# EAGLE design fethe (EAGLE 4.13)
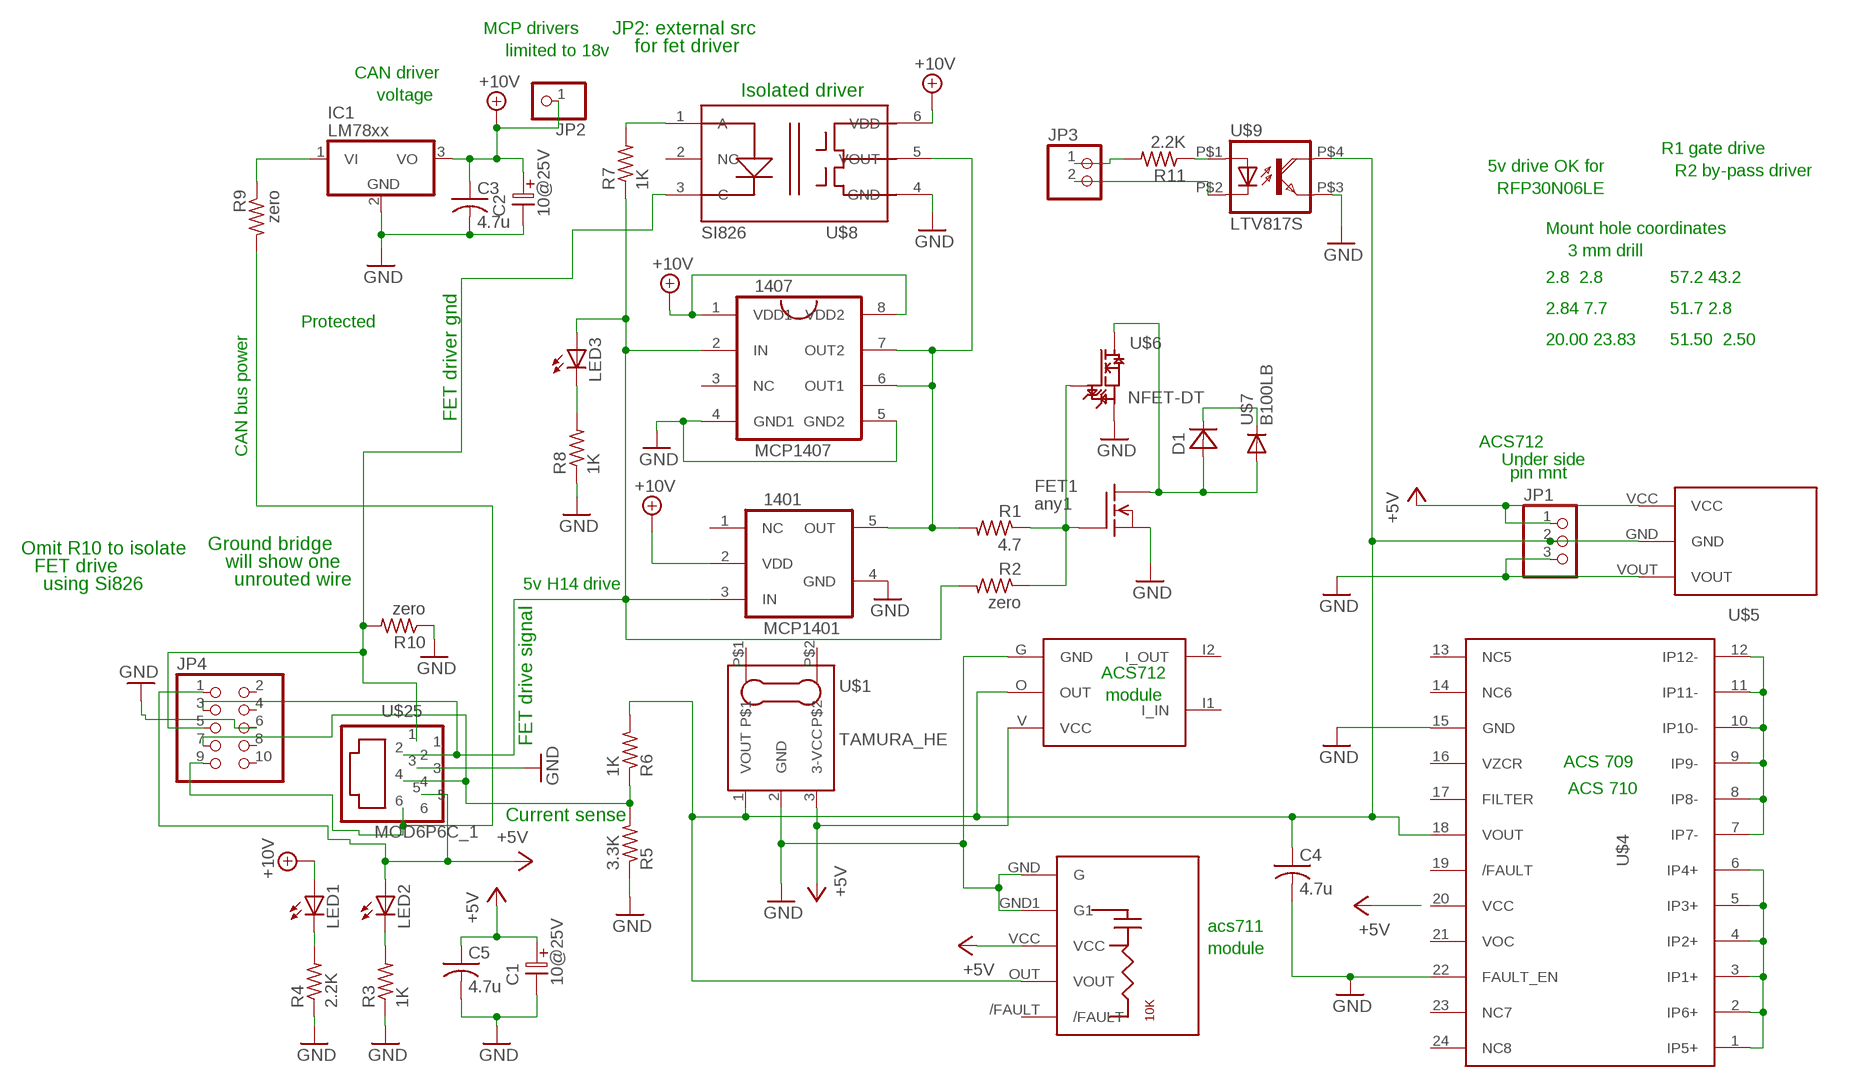
[diagram p0: schematic, sheet 1]

## Parts
1401  MCP1401  MCP1416  [SOT23-5]
1407  MCP1407  [SO8]
C1  10@25V  ELC-2,5L  [ES-2,5L]
C2  10@25V  ELC-2,5L  [ES-2,5L]
C3  4.7u  C-USC0603  [C0603]
C4  4.7u  C-USC0603  [C0603]
C5  4.7u  C-USC0603  [C0603]
D1  DIODE-10  [D-10]
FET1  any1  FET220V  [TO220V]
IC1  LM78xx  78V  [TO220V]
JP1  PINHD-1X3  [1X03]
JP2  PINHD-1X1  [1X01]
JP3  PINHD-1X2  [1X02]
JP4  PINHD-2X5  [2X05]
LED1  LEDCHIPLED_0805  [CHIPLED_0805]
LED2  LEDCHIPLED_0805  [CHIPLED_0805]
LED3  LEDCHIPLED_0805  [CHIPLED_0805]
R1  4.7  R-US_R0603  [R0603]
R2  zero  R-US_R0603  [R0603]
R3  1K  R-US_R0603  [R0603]
R4  2.2K  R-US_R0603  [R0603]
R5  3.3K  R-US_R0603  [R0603]
R6  1K  R-US_R0603  [R0603]
R7  1K  R-US_R0603  [R0603]
R8  1K  R-US_R0603  [R0603]
R9  zero  R-US_R0603  [R0603]
R10  zero  R-US_R0603  [R0603]
R11  2.2K  R-US_R0603  [R0603]
U$1  TAMURA_HE  [TAMURA_HE]
U$2  ACS712MODULE  [ACS712MODULE]
U$3  ACS711MODULE  [ACS711MODULE]
U$4  ACS709/710  [SO24W]
U$5  ACS755  [ACS755]
U$6  NFET-DT  [D-PAK-4]
U$7  B100LB  [SMB_1]
U$8  SI826  [SDIP6]
U$9  LTV817S  LTV316S  [LTV316]
U$25  MOD6P6C_1  [MOD6P6C_1]

## Nets
+5V: C1.1 C5.1 JP1.1 JP4.1 LED2.A U$1.3(3-VCC) U$2.V(VCC) U$3.VCC U$5.VCC U$25.5
+10V: 1401.2(VDD) 1407.1(VDD1) 1407.8(VDD2) C2.1 C3.1 IC1.3(VO) JP2.1 LED1.A U$8.6(VDD)
B5BUF: 1401.3(IN) 1407.2(IN) JP4.3 LED3.A R2.2 R7.1 U$25.2
DIV1: JP4.7 R5.2 R6.1 U$25.4
DRV_OUT: 1401.5(OUT) 1407.6(OUT1) 1407.7(OUT2) R1.2 U$8.5(VOUT)
FET-DRAIN: D1.1(A) FET1.2(D) U$6.D U$7.A
FET_DRIVE_1: FET1.1(G) R1.1 R2.1 U$6.G
GND: 1401.4(GND) 1407.4(GND1) 1407.5(GND2) C1.2 C2.2 C3.2 C4.2 C5.2 FET1.3(S) IC1.2(GND) JP1.3 JP4.6 R3.1 R4.1 R5.1 R8.1 R10.1 U$1.2(GND) U$2.G(GND) U$3.GND1(G1) U$3.GND(G) U$4.15(GND) U$4.22(FAULT_EN) U$5.VOUT U$6.S U$8.4(GND) U$9.P$3(EMI) U$25.3
GNDFETDRV: JP4.5 R10.2 U$8.3(C) U$25.1
I+: U$4.1(IP5+) U$4.2(IP6+) U$4.3(IP1+) U$4.4(IP2+) U$4.5(IP3+) U$4.6(IP4+)
I-: U$4.7(IP7-) U$4.8(IP8-) U$4.9(IP9-) U$4.10(IP10-) U$4.11(IP11-) U$4.12(IP12-)
ISO_IN_A: R11.1 U$9.P$1(A)
ISO_IN_C: JP3.2 U$9.P$2(C)
ISO_IN_PLUS: JP3.1 R11.2
LED1: LED1.C R4.2
LED2: LED2.C R3.2
LED3: LED3.C R8.2
POWER_PLUS: D1.2(K) U$7.C
SI826A: R7.2 U$8.1(A)
VI_12V: JP4.9 R9.2 U$25.6
VOUT: C4.1 JP1.2 R6.2 U$1.1(VOUT) U$2.O(OUT) U$3.OUT(VOUT) U$4.18(VOUT) U$5.GND U$9.P$4(COL)
VRIN: IC1.1(VI) R9.1
Unconnected: 1401.1(NC) 1407.3(NC) JP4.2 JP4.4 JP4.8 JP4.10 U$1.P$1 U$1.P$2 U$2.I1(I_IN) U$2.I2(I_OUT) U$3./FAULT U$4.13(NC5) U$4.14(NC6) U$4.16(VZCR) U$4.17(FILTER) U$4.19(/FAULT) U$4.20(VCC) U$4.21(VOC) U$4.23(NC7) U$4.24(NC8) U$8.2(NC)

## Notes on the sheet
- MCP drivers | JP2: external src
- limited to 18v | for fet driver
- CAN driver
- voltage | Isolated driver
- R1 gate drive
- 5v drive OK for | R2 by-pass driver
- RFP30N06LE
- Mount hole coordinates
- 3 mm drill
- 2.8  2.8 | 57.2 43.2
- 2.84 7.7 | 51.7 2.8
- Protected
- 20.00 23.83 | 51.50  2.50
- FET driver gnd
- ACS712
- CAN bus power
- Under side
- pin mnt
- Omit R10 to isolate | Ground bridge
- FET drive | will show one
- using Si826 | unrouted wire | 5v H14 drive
- ACS712
- module
- FET drive signal
- ACS 709
- ACS 710
- Current sense
- acs711
- module

## Library data of the parts
1401 = DEH:MCP1416
1407 = DEH:MCP1407
C1 C2 = DEH:ELC-2,5L
C3-C5 = rcl:C-US: CAPACITOR, American symbol
D1 = DEH:DIODE-10
FET1 = transistor-fet:FET220V
IC1 = linear:78*: Positive VOLTAGE REGULATOR
JP1 = pinhead:PINHD-1X3: PIN HEADER
JP2 = pinhead:PINHD-1X1: PIN HEADER
JP3 = pinhead:PINHD-1X2: PIN HEADER
JP4 = pinhead:PINHD-2X5: PIN HEADER
LED1-LED3 = led:LED: LED OSRAM: - CHIPLED LG R971, LG N971, LY N971, LG Q971, LY Q971, LO R971, LY R971 LH N974, LH R974 LS Q976, LO Q976, LY Q976 LO Q996 - Hyper CHIPLED LW Q18S LB Q993, LB Q99A, LB R99A - SideLED LS A670, LO A670, LY A670, LG A670, LP A670 LB A673, LV A673, LT A673, LW A673 LH A674 LY A675 LS A676, LA A676, LO A676, LY A676, LW A676 LS A679, LY A679, LG A679 - Hyper Micro SIDELED® LS Y876, LA Y876, LO Y876, LY Y876 LT Y87S - SmartLED LW L88C, LW L88S LB L89C, LB L89S, LG L890 LS L89K, LO L89K, LY L89K LS L896, LA L896, LO L896, LY L896 - TOPLED LS T670, LO T670, LY T670, LG T670, LP T670 LSG T670, LSP T670, LSY T670, LOP T670, LYG T670 LG T671, LOG T671, LSG T671 LB T673, LV T673, LT T673, LW T673 LH T674 LS T676, LA T676, LO T676, LY T676, LB T676, LH T676, LSB T676, LW T676 LB T67C, LV T67C, LT T67C, LS T67K, LO T67K, LY T67K, LW E67C LS E67B, LA E67B, LO E67B, LY E67B, LB E67C, LV E67C, LT E67C LW T67C LS T679, LY T679, LG T679 LS T770, LO T770, LY T770, LG T770, LP T770 LB T773, LV T773, LT T773, LW T773 LH T774 LS E675, LA E675, LY E675, LS T675 LS T776, LA T776, LO T776, LY T776, LB T776 LHGB T686 LT T68C, LB T68C - Hyper Mini TOPLED® LB M676 - Mini TOPLED Santana® LG M470 LS M47K, LO M47K, LY M47K Source: http://www.osram.convergy.de/
R1-R11 = rcl:R-US_: RESISTOR, American symbol
U$1 = DEH:TAMURA_HE
U$2 = DEH:ACS712MODULE
U$3 = DEH:ACS711MODULE
U$4 = DEH:ACS709/710
U$5 = DEH:ACS755
U$6 = DEH:NFET-DT
U$7 = diode-1:B100LB
U$8 = DEH:SI826
U$9 = optocoupler:LTV316S
U$25 = DEH:MOD6P6C_1

## Board
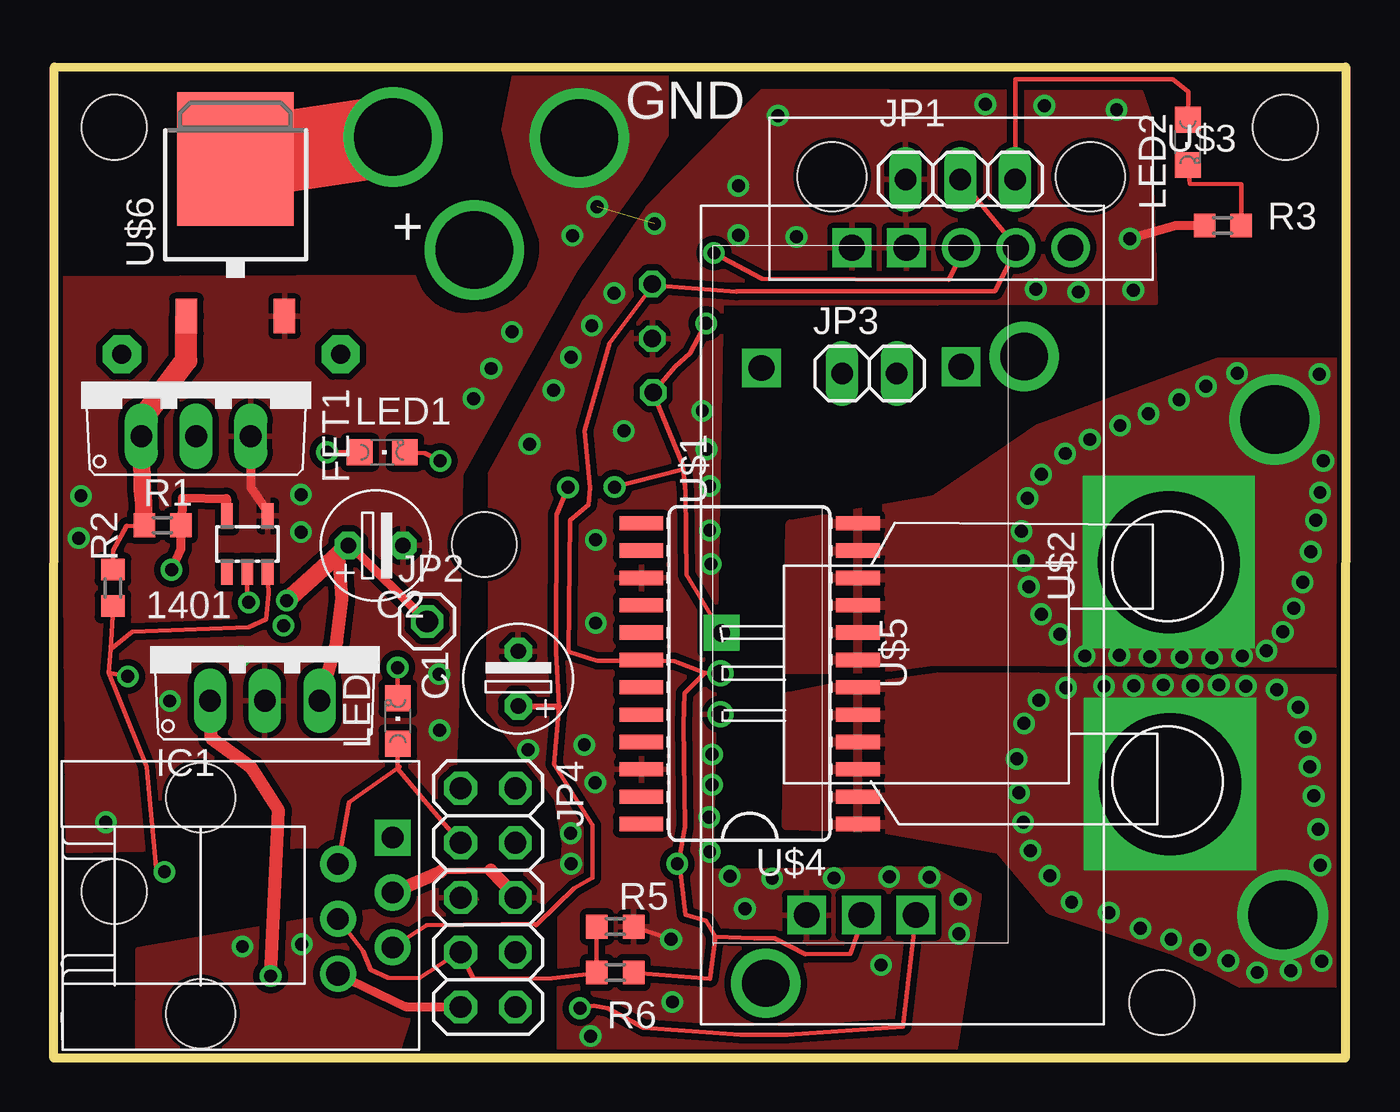
[diagram p1: board, top side]
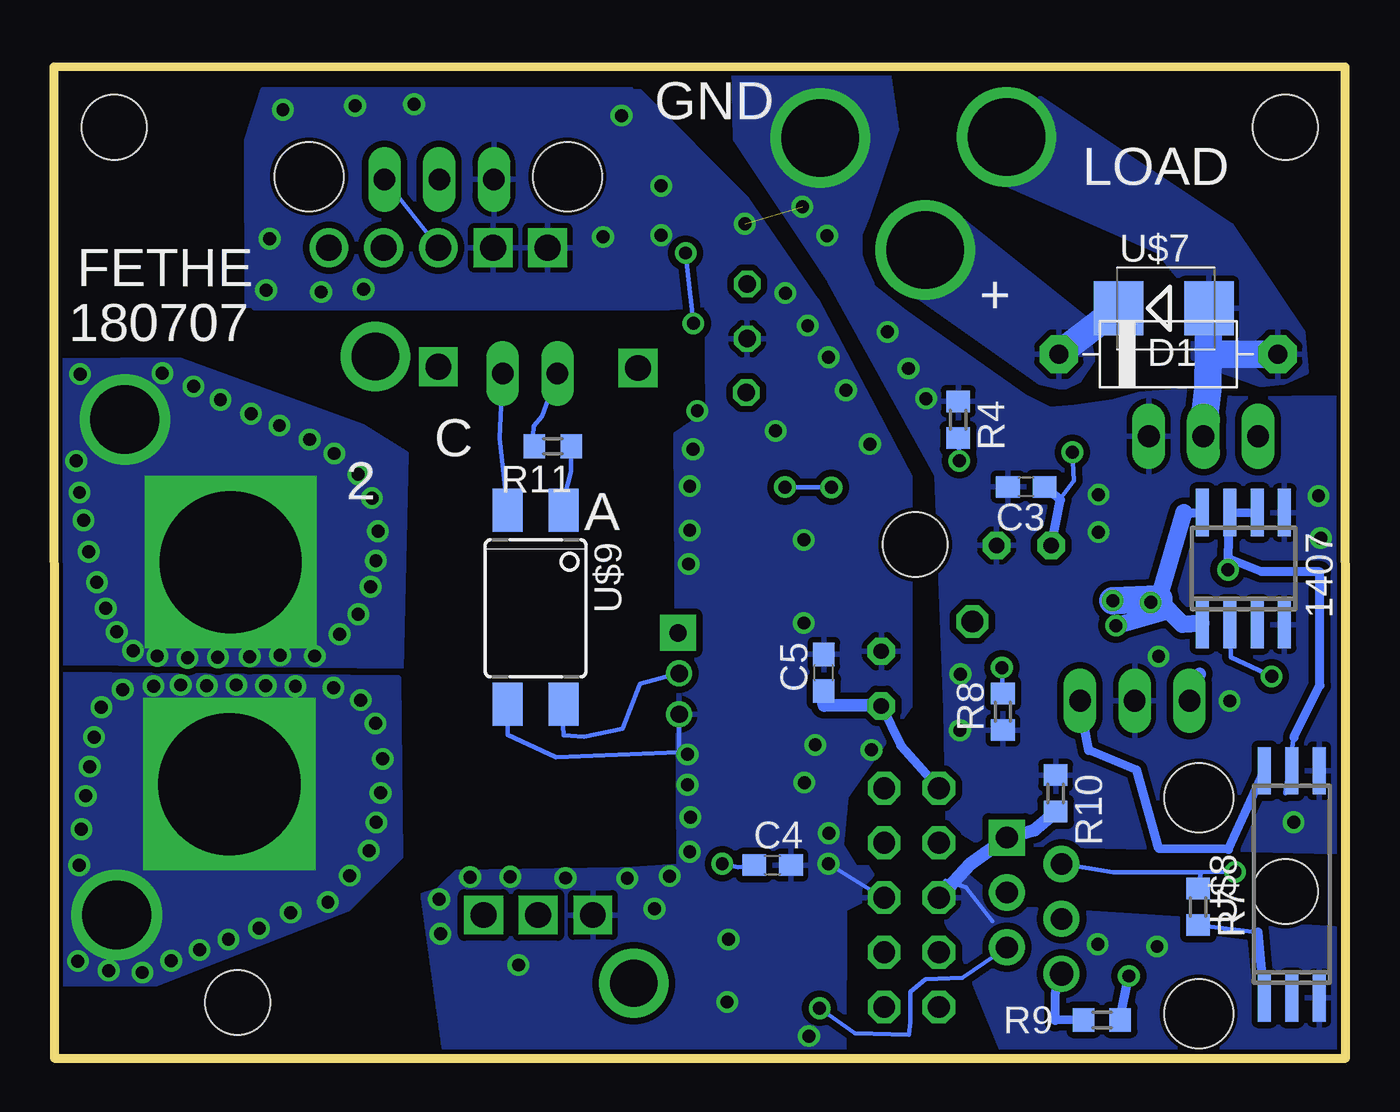
[diagram p2: board, bottom side, seen from below]

Size 60.01 x 46.02 mm. Coordinates in mm from the lower left corner, seen from the top.
Outline: 0,0 0.02,46.01 60.01,46.02 59.98,0 0,0
Copper layers (1*16): Top 0.035mm / dielectric 1.5mm / Bottom 0.035mm
Design rules "default": minimum track width 8mil, minimum drill 0.6mm, track to track 12mil, track to pad 10mil, pad to pad 10mil, via to via 8mil, smd to smd 0mil, copper to edge 8mil, drill to drill 8mil, minimum pad ring 8mil, minimum via ring 8mil, stop-mask expansion 4mil, vias tented up to drill 0mil, thermal gap 10mil
Holes 3 mm at 2.81,43.22 57.21,43.22 51.47,2.58 20,23.85 2.81,7.73

### Footprints (pad centres in the part's own frame; a part is rotated, then mirrored left to right if it is on the bottom)
SOT23-5 = smd 0.55 x 1.2: 1 -0.95,-1.3; 2 0,-1.3; 3 0.95,-1.3; 4 0.95,1.3; 5 -0.95,1.3
SO8 = smd 0.6 x 2.2: 1 -1.905,-2.6; 2 -0.635,-2.6; 3 0.635,-2.6; 4 1.905,-2.6; 5 1.905,2.6; 6 0.635,2.6; 7 -0.635,2.6; 8 -1.905,2.6
ES-2,5L = drill 0.711 pad 1.27 octagon: 1 0,0; 2 2.54,0
C0603 = smd 1.1 x 1: 1 -0.85,0; 2 0.85,0
D-10 = drill 0.889 pad 1.778 octagon: 1 -5.08,0; 2 5.08,0
TO220V = drill 1.016 long: 1 -2.54,-2.54; 2 0,-2.54; 3 2.54,-2.54
TO220V' = drill 1 long: 1 -2.54,1.27; 2 0,1.27; 3 2.54,1.27
1X03 = drill 1 long: 1 -2.54,0; 2 0,0; 3 2.54,0
1X01 = drill 1 octagon: 1 0,0
1X02 = drill 1 long: 1 -1.27,0; 2 1.27,0
2X05 = drill 1.016 octagon: 1 -5.08,-1.27; 2 -5.08,1.27; 3 -2.54,-1.27; 4 -2.54,1.27; 5 0,-1.27; 6 0,1.27; 7 2.54,-1.27; 8 2.54,1.27; 9 5.08,-1.27; 10 5.08,1.27
CHIPLED_0805 = smd 1.2 x 1.2: A 0,-1.05; C 0,1.05
R0603 = smd 1 x 1.1: 1 -0.85,0; 2 0.85,0
TAMURA_HE = drill 0.813 octagon: 1 -17.87,-5.27; 2 -15.33,-5.27; 3 -12.83,-5.23 | drill 2.2: P$1 -14.5,12; P$2 14.6,0
ACS712MODULE = drill 1.2 pad 1.676 square: G -2.54,0; I1 4.636,25.463; I2 -4.636,25.4; O 0,0; V 2.54,0
ACS711MODULE = drill 1.2 pad 1.676: /FAULT 5.08,0; OUT 2.54,0; VCC 0,0 | drill 1.2 pad 1.676 square: GND -5.08,0; GND1 -2.54,0 | hole 3.2: 6,3.3; -6,3.3
SO24W = smd 0.66 x 2.032: 1 -6.985,-6.299; 2 -5.715,-6.299; 3 -4.445,-6.299; 4 -3.175,-6.299; 5 -1.905,-6.299; 6 -0.635,-6.299; 7 0.635,-6.299; 8 1.905,-6.299; 9 3.175,-6.299; 10 4.445,-6.299; 11 5.715,-6.299; 12 6.985,-6.299; 13 6.985,3.759; 14 5.715,3.759; 15 4.445,3.759; 16 3.175,3.759; 17 1.905,3.759; 18 0.635,3.759; 19 -0.635,3.759; 20 -1.905,3.759; 21 -3.175,3.759; 22 -4.445,3.759; 23 -5.715,3.759; 24 -6.985,3.759
ACS755 = drill 0.8: GND 0,-3; VOUT 1.9,-3 | drill 0.8 pad 1.676 square: VCC -1.88,-2.94
D-PAK-4 = smd 5.4 x 6.2: D 0,-0.04 | smd 1 x 1.6: G -2.28,-7.34; S 2.28,-7.34
SMB_1 = smd 2.3 x 2.5: A 1.9,0; C -2.3,0
SDIP6 = smd 0.6 x 2.2: 1 -1.895,-5.33; 2 -0.625,-5.33; 3 0.645,-5.33; 4 0.645,5.22; 5 -0.625,5.22; 6 -1.895,5.22
LTV316 = smd 1.4 x 2: P$1 -1.3,-4.5; P$2 1.3,-4.5; P$3 1.3,4.5; P$4 -1.3,4.5
MOD6P6C_1 = drill 1 pad 1.676 square: 1 -3.175,8.898 | drill 1 pad 1.676: 2 -1.951,6.358; 3 -0.627,8.898; 4 0.597,6.358; 5 1.921,8.898 | drill 1.1 pad 1.676: 6 3.145,6.358 | hole 3.2: -5.029,-0.01; 4.999,-0.01

### Placement (x,y rotation side)
1401  8.99,23.87 0 top
1407  4.75,22.73 0 bottom
C1  21.57,16.35 90 top
C2  13.68,23.8 0 top
C3  14.84,26.52 180 bottom
C4  26.62,8.96 0 bottom
C5  24.24,17.89 90 bottom
D1  8.24,32.68 180 bottom
FET1  6.61,31.41 0 top
IC1  LM78xx  [TO220V']  9.8,15.32 0 top
JP1  42.11,40.8 180 top
JP2  17.34,20.27 0 top
JP3  37.89,31.78 0 top
JP4  20.17,7.45 270 top
LED1  15.26,28.13 270 top
LED2  52.67,42.52 180 top
LED3  15.98,15.65 0 top
R1  5.05,24.74 0 top
R2  2.75,21.83 270 top
R3  54.3,38.66 0 top
R4  18,29.64 270 bottom
R5  26.08,6.1 180 top
R6  26.08,3.97 0 top
R7  6.85,7.02 270 bottom
R8  15.92,16.08 90 bottom
R9  11.32,1.77 180 bottom
R10  13.47,12.29 270 bottom
R11  36.83,28.41 180 bottom
U$1  33.07,18.07 270 top
U$2  37.51,6.64 0 top
U$3  42.15,37.63 0 top
U$4  31.05,17.85 90 top
U$5  33.96,17.86 270 top
U$6  8.44,41.79 0 top
U$7  8.25,34.81 0 bottom
U$8  1.88,8.12 0 bottom
U$9  37.63,20.93 180 bottom
U$25  6.84,7.06 270 top

### Tracks (layer width: path | path; a pad name or v marks a point on that pad's centre or on a via)
+5V  (via drill 0.6)
  Top 0.203: U$5.VCC 29.4,22.43 29.34,26.29 | 29.34,26.29 29.2,27.57 U$1.3 28.86,32.09 29.55,32.72 v30.3,34.11 | v23.89,26.5 23.35,25.22 23.33,18.87 23.47,16.32 23.24,13.65 25.03,10.8 25.02,8.36 24.16,7.88 22.47,6.24 | v26.05,26.51 25.8,26.46 29.25,27.34 29.34,26.29 | v30.66,37.38 32.89,36.19 41.58,36.15 42.3,37.61 U$3.VCC | U$2.V 39.44,1.45 34.07,1.07 31.89,1.09 27.39,1.4 25.73,2.32 25.1,2.42 v24.44,2.31 | JP1.1 44.67,40.73 44.67,45.46 51.98,45.44 52.69,44.86 52.67,43.55 LED2.A | 22.47,6.24 22.4,6.17 | U$25.5 17.31,6.17 22.48,6.23 22.47,6.24
  Top 0.305: C1.1 23.47,16.32
  Bottom 0.203: v23.89,26.5 v26.05,26.51 | v30.3,34.11 v30.66,37.38 | U$3.VCC 42.12,37.61 JP1.1 | U$25.5 17.8,3.72 19.53,3.66 20.23,3.07 20.22,1.68 20.29,1.08 22.8,1.16 v24.44,2.31
  Bottom 0.406: JP4.1 20.67,14.51 C1.1
  Bottom 0.61: C1.1 24.23,16.37 24.24,16.98 C5.1
+10V  (via drill 0.6)
  Top 0.203: 1401.2 8.97,21.59 v9.06,21.16 | C2.1 | v12.7,28.13 LED1.A
  Top 0.406: C2.1 13.74,23.84 JP2.1
  Top 0.61: IC1.3 13.14,19.31 13.39,21.32 13.25,23.22 13.68,23.94 C2.1
  Top 0.813: C2.1 v10.82,21.24
  Bottom 0.203: 8.67,21.32 v9.06,21.16 | v12.7,28.13 12.62,26.81 13.28,25.94
  Bottom 0.406: C3.1 13.28,25.94 13.25,25.92 C2.1 | 7.52,25.33 1407.8 | 6.74,20.18 1407.1 | U$8.6 5.45,9.69 8.67,9.72 9.71,13.37 11.94,14.28 12.38,16.55 IC1.3
  Bottom 0.813: v9.06,21.16 8.7,21.29 | 8.7,21.29 7.52,25.33 | 8.7,21.29 7.59,20.15 6.74,20.18 | v10.82,21.24 8.31,20.75 v10.68,20.07 v10.67,20.08
  Bottom 1.27: v10.82,21.24 8.67,21.32
B5BUF  (via drill 0.6)
  Top 0.203: 2.56,17.89 4.32,13.53 4.76,8.82 v5.14,8.64 | 9.99,22.57 1401.3 9.97,21.58 9.87,20.38 9.06,20.01 3.64,19.8 2.65,18.98 2.63,18.98 | R2.2 2.76,20.92 2.63,18.98 | 2.56,17.89 2.63,18.98 | v3.44,17.72 3.45,17.7 2.56,17.89 | JP4.3 17.72,11.37 15.96,13.44 15.96,13.53 | LED3.A 15.97,14.71 15.96,13.53 | U$25.2 13.71,11.87 16.07,13.53 15.96,13.53
  Bottom 0.203: 1407.2 5.34,18.62 v3.44,17.72 | 6.72,8.62 R7.1 | v5.14,8.64 6.72,8.62 | 6.72,8.62 10.81,8.63 13.21,9.03 U$25.2
DIV1
  Top 0.203: 25.21,4.39 25.21,3.87 | 25.21,4.39 25.21,5.89 | 25.21,5.89 25.21,6.27 | 25.21,5.89 25.1,5.89 R5.2 | 25.21,4.39 25.1,4.39 R6.1 25.16,3.94 23.15,3.71 19.51,3.69 18.88,4.92 JP4.7 18.9,4.96 16.97,3.71 15.53,3.73 14.72,4.11 14.36,4.96 U$25.4
DRV_OUT  (via drill 0.6)
  Top 0.203: R1.2 5.97,24.74
  Top 0.406: v5.47,22.67 5.91,23.64 5.94,24.73 R1.2 | 1401.5 8.02,25.98 5.98,26.01 5.97,24.74
  Bottom 0.203: 1407.7 5.41,25.35 | U$8.5 2.81,12.3 2.41,14.89
  Bottom 0.406: 1407.7 v5.47,22.67 5.39,23.15 3.91,22.59 1.2,22.57 1.2,17.3 2.41,14.89 | 5.41,25.35 1407.6
FET-DRAIN  (via drill 3.6)
  Top 3.81: v15.76,42.76 15.57,42.82 U$6.D
  Bottom 1.27: D1.1 6.38,32.67 U$7.A 6.4,31.05 6.62,29.28 6.61,28.07 FET1.2
  pour Bottom: 14.19,44.58 5.29,38.68 1.96,33.73 1.8,31.84 2.9,31.35 3.95,31.23 5.56,31.82 7.1,32.49 7.07,35.42 8.72,37.47 16.99,41.1
FET_DRIVE_1
  Top 0.203: R2.1 2.76,23.58 3.39,24.71 4.19,24.68 R1.1 | 4.08,28.11 4.09,28.11
  Top 0.813: R1.1 4.17,25.78 4.11,26.42 4.08,28.11
  Top 1.016: U$6.G 6.15,32.4 4.15,29.72 4.09,28.07 4.09,28.11 FET1.1
GND  (via drill 0.6, 3.6)  (1 unrouted)
  Top 0.203: R5.1 v28.67,5.51 | v27.91,38.74 27.95,38.73
  Top 0.305: 18.01,8.68 20.31,8.72
  Top 0.406: FET1.3 9.16,26.49 9.94,25.37 1401.4 | R3.1 52.12,38.66 49.91,38.04 v49.98,38.04
  Top 0.61: U$25.3 18.01,8.68 | JP4.6 21.43,7.55 20.31,8.72
  Bottom 0.203: v28.67,5.51 28.55,5.89 | U$5.VOUT 30.96,14.19 36.69,13.96 38.94,15.02 38.96,16.42 U$9.P$3 | JP4.6 21.49,7.44 v24.03,9.02
  other vias: 30.12,30.05 30.32,28.27 30.47,26.56 30.47,24.5 30.52,22.94 30.57,14.1 30.57,12.69 30.44,11.18 30.47,9.58 31.4,8.45 33.37,8.34 38.81,8.42 36.24,8.36 32.11,6.93 40.67,8.4 42.11,7.37 42.05,5.77 38.43,4.32 25.17,20.2 25.17,24.06 24.64,14.54 26.48,29.12 22.1,28.51 31.8,40.5 33.64,43.76 49.37,44.03 43.27,44.29 50.15,35.66 47.59,35.57 45.62,35.7 34.5,38.13 31.8,38.21 24.41,42.72 25.24,39.53 24.09,38.19 26.03,35.52 24.02,32.54 24.99,34.01 23.21,31.01 21.28,33.72 20.31,32.02 19.49,30.62 11.48,26.16 11.48,24.42 1.26,26.1 17.9,17.83 1.16,24.14 28.73,2.6 24.93,1.02 24.01,10.44 25.15,12.79 22.03,14.31 46.01,44.22 17.92,15.22 8.69,18.65 5.39,16.58 2.42,10.95
  pour Bottom: 23.61,7.03 23.63,0.39 41.87,0.38 42.88,7.59 40.62,8.31 31,8.93 31.12,28.99 29.65,30.02 29.69,35.11 31.78,34.93 51.05,34.93 51.07,42.61 50.31,44.98 33.19,45.01 29.06,38.09 27.75,35.35 22.8,27.29 23.82,10.07 23.53,8.91 22.83,8.88 22.57,7.66 22.68,7.34
  pour Top: 43.01,7.57 41.89,0.37 23.46,0.41 23.5,6.91 21.57,7.72 21.98,8.71 23.66,9.2 23.7,9.97 23.35,11.98 20.19,16.12 20.19,19.82 20.26,19.82 20.26,27.12 24.67,35.16 27.58,39.48 32.91,44.91 50.51,44.85 50.89,43.76 51.18,35.06 31.02,35.02 30.54,8.7 40.79,8.81
  pour Bottom: 23.27,6.91 23.29,0.27 41.53,0.26 42.54,7.47 41.3,8.66 30.66,8.81 30.78,28.87 29.31,29.9 29.35,34.99 31.44,34.81 50.71,34.81 50.73,42.49 49.97,44.86 32.81,44.91 27.79,39.88 24.55,35.19 20.22,26.96 20.22,16.33 23.18,12.1 23.4,9.9 22.76,8.86 22.22,8.89 21.8,8.25 22.32,7.37
  pour Bottom (rank 3): 18.6,16.19 19.02,27.09 23.98,36.07 28.37,42.64 28.44,45.99 21.31,46.34 20.84,43.1 22.18,39.17 22.53,38.27 22.54,37.27 22.4,36.83 21.99,35.92 22.09,35.95 20.46,34.66 14.78,30.65 13.76,30.14 12.57,30.25 10.79,30.49 9.59,30.84 7.5,31.01 5.19,30.64 -0.17,30.68 0.48,9.56 16.99,9.94 18.5,10.88
  pour Top (rank 3): 18.71,15.6 18.63,14.05 18.57,11.03 18.16,10.65 17,9.93 0.65,9.6 0.4,36.22 16.74,36.29 arc90 19.71,34.58 19.92,34.54 arc90 22.64,38.04 22.23,39.07 21.38,41.11 20.89,43.13 21.41,45.72 28.47,45.7 28.45,42.84 27.27,40.84 24.24,36.59 18.93,27.09
GNDFETDRV  (via drill 0.6)
  Bottom 0.203: 16.42,6.35 17.65,7.94 18.59,8.23
  Bottom 0.61: R10.2 14.45,10.59 15.73,10.21 U$25.1 17.43,9.02 18.92,7.4 JP4.5
  other vias: 11.52,5.28 8.76,5.18
  pour Bottom: 0.12,6 15.81,7 17.79,8.65 18.59,6.43 17.76,4.72 15.95,0.29 0.22,0.25
  pour Top: 3.9,5.06 11.84,6.42 15.81,6.98 18.59,8.6 19.67,7.35 17.96,6.4 16,0.29 3.87,0.31
I+  (via drill 0.6, 3.2, 6.6 pad 8)
  other vias: 51.85,12.72 45.37,9.63 45.03,10.94 44.83,12.31 44.73,13.89 45.07,15.54 45.75,16.62 47.02,17.19 46.26,8.47 47.28,7.24 49.01,6.75 50.48,6.02 51.9,5.51 53.24,5.02 54.56,4.52 55.38,17.27 48.79,17.26 58.83,8.95 58.73,10.62 58.53,12.17 58.34,13.53 58.14,14.9 57.8,16.29 56.81,17.11 57.09,6.64 58.89,4.5 50.16,17.29 51.53,17.32 52.9,17.29 54.12,17.32 55.9,3.97 57.46,4.06
  pour Top: 59.56,17.64 59.77,3.48 55.14,3.46 53.55,4.26 52.72,4.64 51.82,5.04 46.3,6.87 43.92,9.68 38.65,10.59 34.03,10.79 34.13,16.8 36.41,17.26 38.07,17.3 41.21,17.72
  pour Bottom: 44.01,17.63 59.54,17.8 59.88,3.48 55.33,3.46 46.34,6.95 43.92,9.35
I-  (via drill 0.6, 3.2, 6.6 pad 8)
  other vias: 51.79,23.03 45.87,27.1 45.23,26 44.95,24.46 45.05,23.09 45.29,21.88 45.87,20.61 46.98,28.07 48.13,28.72 49.53,29.37 50.85,29.92 52.27,30.57 53.52,31.19 54.97,31.8 58.79,31.76 58.97,27.73 58.82,26.26 58.63,24.97 58.39,23.51 58.01,22.09 57.6,20.88 46.73,19.68 57.09,19.79 56.71,29.65 47.89,18.67 49.5,18.7 50.91,18.64 52.39,18.61 53.8,18.58 55.2,18.67 56.33,18.91
  pour Top (rank 2): 45.72,29.23 54.12,32.33 59.52,32.35 59.5,18.11 42.24,18.23 40.04,18.12 37.52,18.03 34.08,18 34.2,24.79 40.93,25.94
  pour Bottom (rank 2): 45.64,29.29 54.2,32.39 59.6,32.36 59.67,18.04 48.07,17.42 43.91,18.02 43.68,28.05
ISO_IN_A
  Bottom 0.203: R11.1 35.98,27.24 36.45,25.45 U$9.P$1
ISO_IN_C
  Bottom 0.203: U$9.P$2 39.3,28.78 JP3.2
ISO_IN_PLUS
  Bottom 0.203: JP3.1 37.32,29.81 37.72,29.34 37.77,28.45 R11.2
LED1  (via drill 0.6)
  Top 0.203: LED1.C 17.25,28.09 v17.95,27.73
  Bottom 0.203: R4.2 17.99,28.86 v17.95,27.73
LED2
  Top 0.203: LED2.C 52.77,40.59 55.15,40.57 55.16,38.61 R3.2
LED3  (via drill 0.6)
  Top 0.203: v15.97,18.13 LED3.C
  Bottom 0.203: v15.97,18.13 15.98,17.94 15.93,16.95 R8.2
POWER_PLUS  (via drill 3.6)
  Bottom 1.27: D1.2 13.36,32.69 U$7.C
  other vias: 19.53,37.52
  pour Bottom (rank 2): 18.61,39.58 12.11,34.39 11.72,32.4 12.35,31.48 13.07,31.12 13.33,31.14 14.22,31.35 21.41,36.41
SI826A
  Bottom 0.203: 4.07,5.85 4.12,5.85 R7.2
  Bottom 0.406: U$8.1 4.07,5.85
VI_12V
  Top 0.406: JP4.9 16.35,2.39 13.17,3.92 U$25.6
  Bottom 0.406: R9.2 13.49,1.75 13.49,2.96 13.35,3.63 U$25.6
VOUT  (via drill 0.6)
  Top 0.203: R6.2 30.49,3.67 30.74,5.63 | 30.74,5.63 32.52,5.57 33.48,5.57 34.91,4.83 37,4.85 37.62,6.57 U$2.O | 30.26,17.88 30.22,17.88 28.84,18.43 28.83,18.42 U$4.18 27.3,18.46 26.77,18.45 25.23,18.44 23.91,18.86 23.99,24.98 24.84,25.69 24.92,26.47 24.65,29.12 25.81,33.19 27.84,35.89 | 30.26,17.88 U$5.GND | 30.74,5.63 30.3,6.38 29.35,6.66 29.04,9.19 | 29.04,9.19 29.31,10.73 29.26,15.5 29.3,16.95 30.26,17.9 30.26,17.88 | 31.7,35.6 31.68,35.6 | 31.7,35.6 43.72,35.6 44.72,37.55 U$3.OUT 44.78,37.57 JP1.2 | 29.04,9.19 v28.96,9.02 | 27.84,35.89 U$1.1 | 31.7,35.6 31.7,35.58 27.84,35.89
  Bottom 0.203: C4.1 28.24,8.86 v28.96,9.02 | U$5.GND 32.79,17.37 33.59,15.28 35.38,14.92 36.33,14.98 36.39,16.34 U$9.P$4
VRIN  (via drill 0.6)
  Top 0.203: 7.28,16.62 IC1.1
  Top 0.61: v10.07,3.81 10.44,11.5 9.16,13.5 7.31,14.85 7.28,16.62
  Bottom 0.406: R9.1 10.48,1.8 v10.07,3.81
  Bottom 0.61: IC1.1 6.79,17.84

### Text on the board
tNames: GND | + | 1401
bNames: GND | LOAD | FETHE | + | 180707 | C | 2 | A